# EAGLE design Triggy (EAGLE 7.5.0)
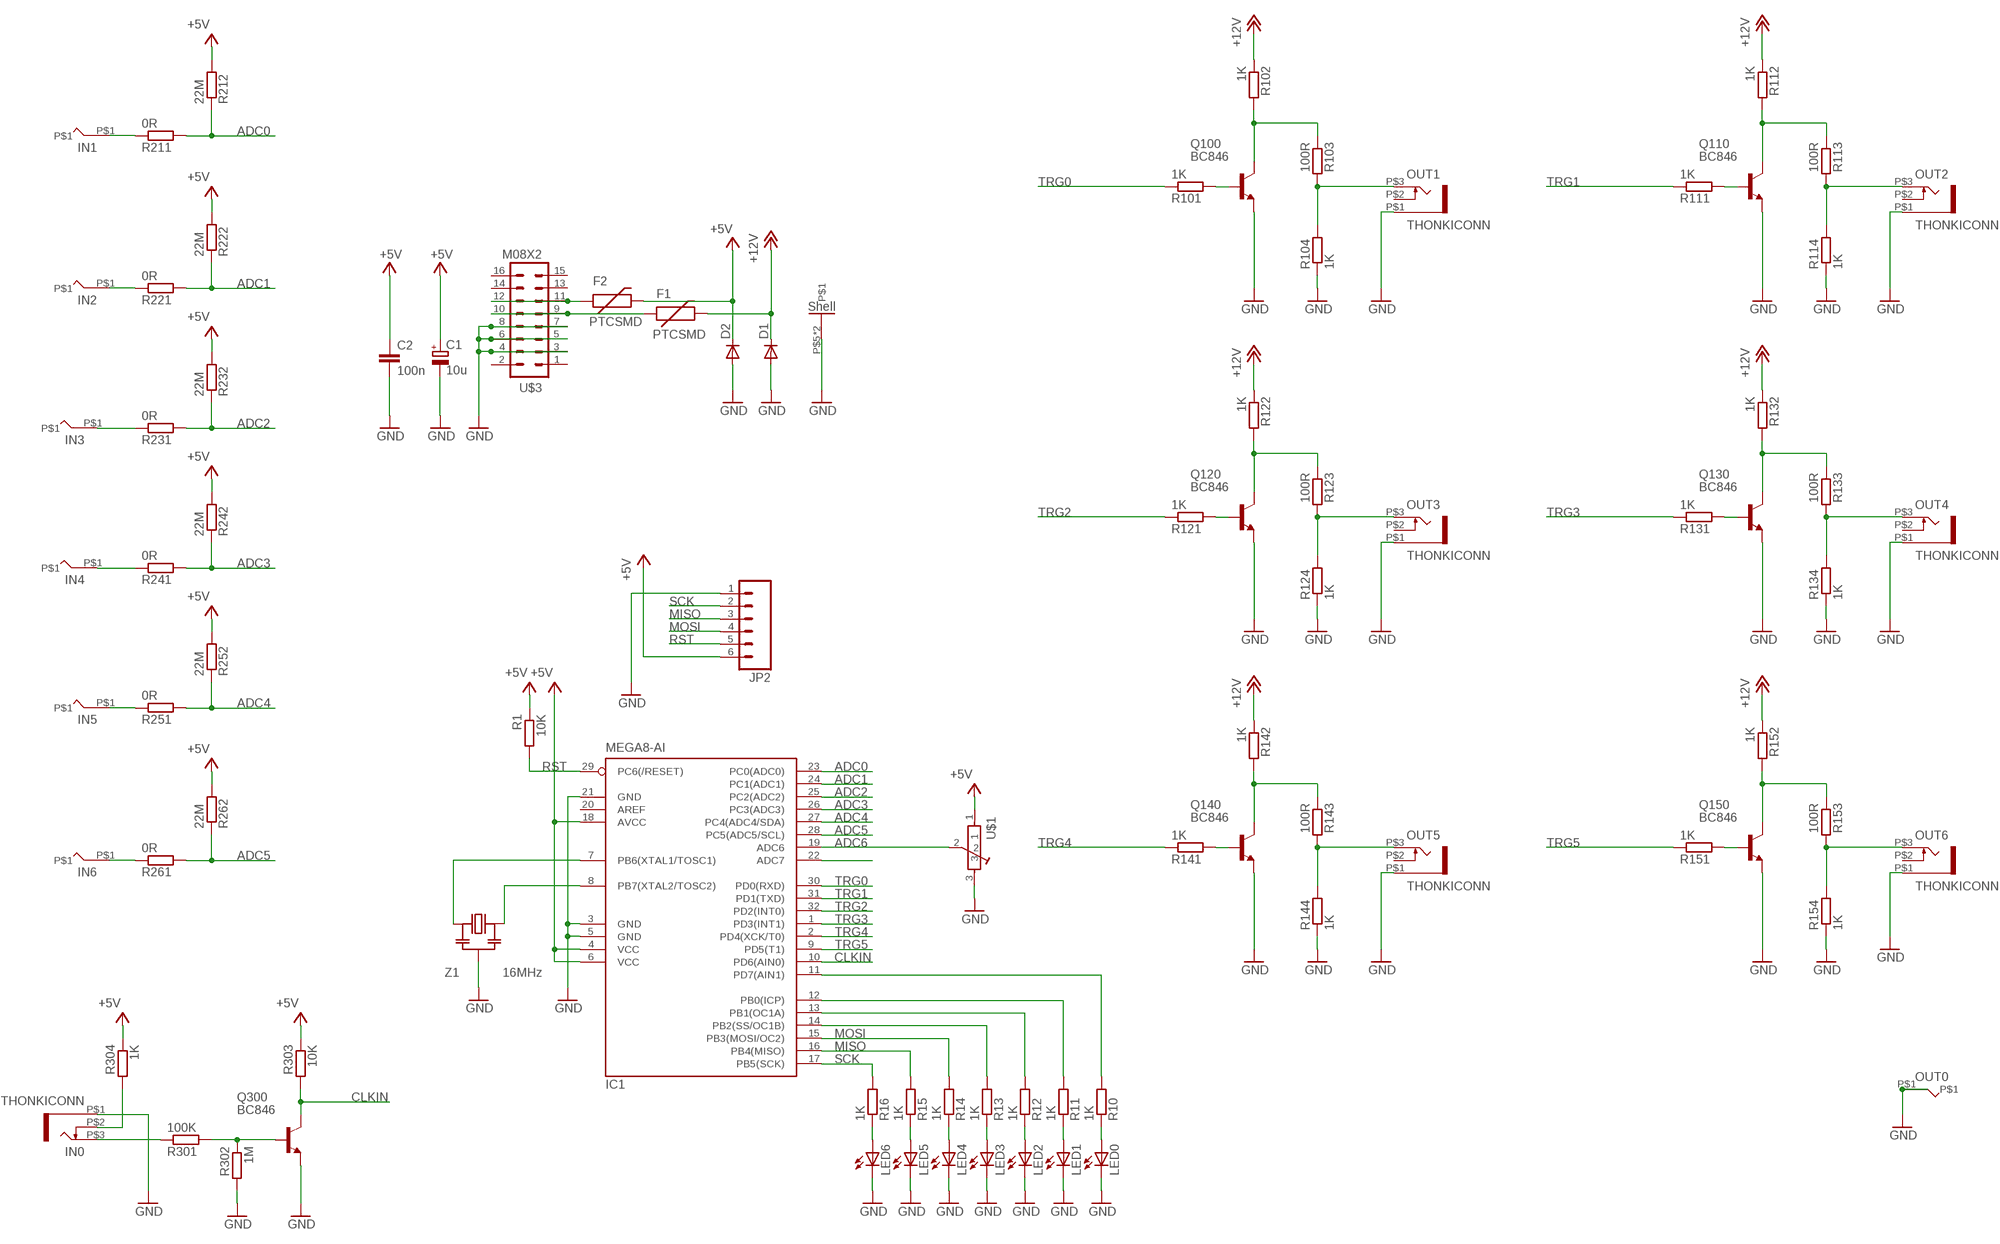
[diagram p0: schematic, sheet 1]

## Parts
C1  10u  CPOL-EUE2.5-6  [E2,5-6]
C2  100n  C-EUC0603  [C0603]
D1  DIODESMA  [SMA-DIODE]
D2  DIODESMA  [SMA-DIODE]
F1  PTCSMD  [PTC-1206]
F2  PTCSMD  [PTC-1206]
IC1  MEGA8-AI  [TQFP32-08]
IN0  THONKICONN  [THONKICONN]
IN1  BANANAJACK  [BANANAJACK]
IN2  BANANAJACK  [BANANAJACK]
IN3  BANANAJACK  [BANANAJACK]
IN4  BANANAJACK  [BANANAJACK]
IN5  BANANAJACK  [BANANAJACK]
IN6  BANANAJACK  [BANANAJACK]
JP2  M06SIP  [1X06]
LED0  LED3MM  [LED3MM]
LED1  LED3MM  [LED3MM]
LED2  LED3MM  [LED3MM]
LED3  LED3MM  [LED3MM]
LED4  LED3MM  [LED3MM]
LED5  LED3MM  [LED3MM]
LED6  LED3MM  [LED3MM]
OUT0  BANANAJACK  [BANANAJACK]
OUT1  THONKICONN  [THONKICONN]
OUT2  THONKICONN  [THONKICONN]
OUT3  THONKICONN  [THONKICONN]
OUT4  THONKICONN  [THONKICONN]
OUT5  THONKICONN  [THONKICONN]
OUT6  THONKICONN  [THONKICONN]
Q100  BC846  [SOT23]
Q110  BC846  [SOT23]
Q120  BC846  [SOT23]
Q130  BC846  [SOT23]
Q140  BC846  [SOT23]
Q150  BC846  [SOT23]
Q300  BC846  [SOT23]
R1  10K  R-EU_0603  [0603]
R10  1K  R-EU_0603  [0603]
R11  1K  R-EU_0603  [0603]
R12  1K  R-EU_0603  [0603]
R13  1K  R-EU_0603  [0603]
R14  1K  R-EU_0603  [0603]
R15  1K  R-EU_0603  [0603]
R16  1K  R-EU_0603  [0603]
R101  1K  R-EU_0603  [0603]
R102  1K  R-EU_0603  [0603]
R103  100R  R-EU_0603  [0603]
R104  1K  R-EU_0603  [0603]
R111  1K  R-EU_0603  [0603]
R112  1K  R-EU_0603  [0603]
R113  100R  R-EU_0603  [0603]
R114  1K  R-EU_0603  [0603]
R121  1K  R-EU_0603  [0603]
R122  1K  R-EU_0603  [0603]
R123  100R  R-EU_0603  [0603]
R124  1K  R-EU_0603  [0603]
R131  1K  R-EU_0603  [0603]
R132  1K  R-EU_0603  [0603]
R133  100R  R-EU_0603  [0603]
R134  1K  R-EU_0603  [0603]
R141  1K  R-EU_0603  [0603]
R142  1K  R-EU_0603  [0603]
R143  100R  R-EU_0603  [0603]
R144  1K  R-EU_0603  [0603]
R151  1K  R-EU_0603  [0603]
R152  1K  R-EU_0603  [0603]
R153  100R  R-EU_0603  [0603]
R154  1K  R-EU_0603  [0603]
R211  0R  R-EU_0603  [0603]
R212  22M  R-EU_0603  [0603]
R221  0R  R-EU_0603  [0603]
R222  22M  R-EU_0603  [0603]
R231  0R  R-EU_0603  [0603]
R232  22M  R-EU_0603  [0603]
R241  0R  R-EU_0603  [0603]
R242  22M  R-EU_0603  [0603]
R251  0R  R-EU_0603  [0603]
R252  22M  R-EU_0603  [0603]
R261  0R  R-EU_0603  [0603]
R262  22M  R-EU_0603  [0603]
R301  100K  R-EU_0603  [0603]
R302  1M  R-EU_0603  [0603]
R303  10K  R-EU_0603  [0603]
R304  1K  R-EU_0603  [0603]
U$1  POT-ALPS-RK09L1140  [POT-ALPS-RK09L1140]
U$3  M08X2  [2X8]
Z1  16MHz  CERAMIC_RESONATOR  [CSTCE_G_A]

## Nets
+5V: C1.+ C2.1 D2.C F2.2 IC1.4(VCC) IC1.6(VCC) IC1.18(AVCC) JP2.6 R1.1 R212.2 R222.2 R232.2 R242.2 R252.2 R262.2 R303.1 R304.1 U$1.1
+12V: D1.C F1.2 R102.1 R112.1 R122.1 R132.1 R142.1 R152.1
ADC0: IC1.23(PC0(ADC0)) R211.2 R212.1
ADC1: IC1.24(PC1(ADC1)) R221.2 R222.1
ADC2: IC1.25(PC2(ADC2)) R231.2 R232.1
ADC3: IC1.26(PC3(ADC3)) R241.2 R242.1
ADC4: IC1.27(PC4(ADC4/SDA)) R251.2 R252.1
ADC5: IC1.28(PC5(ADC5/SCL)) R261.2 R262.1
ADC6: IC1.19(ADC6) U$1.2
ADC7: IC1.22(ADC7)
CLKIN: IC1.10(PD6(AIN0)) Q300.3(C) R303.2
GND: C1.- C2.2 D1.A D2.A IC1.3(GND) IC1.5(GND) IC1.21(GND) IN0.P$1 JP2.1 LED0.K(C) LED1.K(C) LED2.K(C) LED3.K(C) LED4.K(C) LED5.K(C) LED6.K(C) OUT0.P$1 OUT1.P$1 OUT2.P$1 OUT3.P$1 OUT4.P$1 OUT5.P$1 OUT6.P$1 Q100.2(E) Q110.2(E) Q120.2(E) Q130.2(E) Q140.2(E) Q150.2(E) Q300.2(E) R104.1 R114.1 R124.1 R134.1 R144.1 R154.1 R302.2 U$1.3 U$1.P$5 U$1.P$6 U$3.3 U$3.4 U$3.5 U$3.6 U$3.7 U$3.8 Z1.P$2(GND)
MISO: IC1.16(PB4(MISO)) JP2.3 R15.2
MOSI: IC1.15(PB3(MOSI/OC2)) JP2.4 R14.2
N$1: IN6.P$1 R261.1
N$2: F2.1 U$3.11 U$3.12
N$3: IN2.P$1 R221.1
N$4: IN4.P$1 R241.1
N$5: IN0.P$2 R304.2
N$6: IC1.8(PB7(XTAL2/TOSC2)) Z1.P$3(OUT)
N$7: F1.1 U$3.9 U$3.10
N$8: IN1.P$1 R211.1
N$9: IN3.P$1 R231.1
N$10: LED6.A R16.1
N$11: IC1.7(PB6(XTAL1/TOSC1)) Z1.P$1(IN)
N$12: IN5.P$1 R251.1
N$13: IC1.12(PB0(ICP)) R11.2
N$14: Q120.1(B) R121.2
N$15: OUT3.P$3 R123.2 R124.2
N$16: Q120.3(C) R122.2 R123.1
N$17: Q140.1(B) R141.2
N$18: OUT5.P$3 R143.2 R144.2
N$19: Q140.3(C) R142.2 R143.1
N$20: IC1.13(PB1(OC1A)) R12.2
N$21: IC1.14(PB2(SS/OC1B)) R13.2
N$22: LED5.A R15.1
N$23: Q110.1(B) R111.2
N$24: OUT2.P$3 R113.2 R114.2
N$25: Q110.3(C) R112.2 R113.1
N$26: Q130.1(B) R131.2
N$27: Q300.1(B) R301.2 R302.1
N$28: IN0.P$3 R301.1
N$29: OUT4.P$3 R133.2 R134.2
N$30: Q130.3(C) R132.2 R133.1
N$31: IC1.11(PD7(AIN1)) R10.2
N$32: Q150.1(B) R151.2
N$33: Q100.1(B) R101.2
N$34: OUT6.P$3 R153.2 R154.2
N$35: Q150.3(C) R152.2 R153.1
N$36: OUT1.P$3 R103.2 R104.2
N$37: Q100.3(C) R102.2 R103.1
N$38: LED4.A R14.1
N$39: LED3.A R13.1
N$40: LED2.A R12.1
N$41: LED1.A R11.1
N$42: LED0.A R10.1
RST: IC1.29(PC6(/RESET)) JP2.5 R1.2
SCK: IC1.17(PB5(SCK)) JP2.2 R16.2
TRG0: IC1.30(PD0(RXD)) R101.1
TRG1: IC1.31(PD1(TXD)) R111.1
TRG2: IC1.32(PD2(INT0)) R121.1
TRG3: IC1.1(PD3(INT1)) R131.1
TRG4: IC1.2(PD4(XCK/T0)) R141.1
TRG5: IC1.9(PD5(T1)) R151.1
Unconnected: IC1.20(AREF) OUT1.P$2 OUT2.P$2 OUT3.P$2 OUT4.P$2 OUT5.P$2 OUT6.P$2 U$3.1 U$3.2 U$3.13 U$3.14 U$3.15 U$3.16

## Library data of the parts
C1 = resistor:CPOL-EU: POLARIZED CAPACITOR, European symbol
C2 = rcl:C-EU: CAPACITOR, European symbol
D1 D2 = SparkFun:DIODE: Diode These are standard reverse protection diodes and small signal diodes. SMA package can handle up to about 1A. SOD-323 can handle about 200mA. What the SOD-323 package when ordering, there are some mfgs out there that are 5-pin packages.
F1 F2 = SparkFun:PTC: Resettable Fuse PTC Resettable Fuse. Spark Fun Electronics SKU : COM-08357
IC1 = atmel:MEGA8: MICROCONTROLLER 8 Kbytes FLASH, 1 kbytes SRAM, 512 bytes EEPROM, USART, 6-channel 10 bit ADC, 2-channel 8 bit ADC Pin compatible with Atmega48, ATMega88, ATMega168 Source: avr.lbr; MPN: ATMEGA8-16AU; OC_FARNELL: 9171371; OC_NEWARK: 73M8863
IN0 OUT1-OUT6 = Rebel:THONKICONN
IN1-IN6 OUT0 = Rebel:BANANAJACK
JP2 = SparkFun:M06: Header 6 Standard 6-pin 0.1" header. Use with straight break away headers (SKU : PRT-00116), right angle break away headers (PRT-00553), swiss pins (PRT-00743), machine pins (PRT-00117), and female headers (PRT-00115). Molex polarized connector foot print use with SKU : PRT-08094 with associated crimp pins and housings. NOTES ON THE VARIANTS LOCK and LOCK_LONGPADS... This footprint was designed to help hold the alignment of a through-hole component (i.e. 6-pin header) while soldering it into place. You may notice that each hole has been shifted either up or down by 0.005 of an inch from it's more standard position (which is a perfectly straight line). This slight alteration caused the pins (the squares in the middle) to touch the edges of the holes. Because they are alternating, it causes a "brace" to hold the component in place. 0.005 has proven to be the perfect amount of "off-center" position when using our standard breakaway headers. Although looks a little odd when you look at the bare footprint, once you have a header in there, the alteration is very hard to notice. Also, if you push a header all the way into place, it is covered up entirely on the bottom side. This idea of altering the position of holes to aid alignment will be further integrated into the Sparkfun Library for other footprints. It can help hold any component with 3 or more connection pins.
LED0 LED1-LED6 = Rebel:LED: LED OSRAM: - CHIPLED LG R971, LG N971, LY N971, LG Q971, LY Q971, LO R971, LY R971 LH N974, LH R974 LS Q976, LO Q976, LY Q976 LO Q996 - Hyper CHIPLED LW Q18S LB Q993, LB Q99A, LB R99A - SideLED LS A670, LO A670, LY A670, LG A670, LP A670 LB A673, LV A673, LT A673, LW A673 LH A674 LY A675 LS A676, LA A676, LO A676, LY A676, LW A676 LS A679, LY A679, LG A679 - Hyper Micro SIDELED® LS Y876, LA Y876, LO Y876, LY Y876 LT Y87S - SmartLED LW L88C, LW L88S LB L89C, LB L89S, LG L890 LS L89K, LO L89K, LY L89K LS L896, LA L896, LO L896, LY L896 - TOPLED LS T670, LO T670, LY T670, LG T670, LP T670 LSG T670, LSP T670, LSY T670, LOP T670, LYG T670 LG T671, LOG T671, LSG T671 LB T673, LV T673, LT T673, LW T673 LH T674 LS T676, LA T676, LO T676, LY T676, LB T676, LH T676, LSB T676, LW T676 LB T67C, LV T67C, LT T67C, LS T67K, LO T67K, LY T67K, LW E67C LS E67B, LA E67B, LO E67B, LY E67B, LB E67C, LV E67C, LT E67C LW T67C LS T679, LY T679, LG T679 LS T770, LO T770, LY T770, LG T770, LP T770 LB T773, LV T773, LT T773, LW T773 LH T774 LS E675, LA E675, LY E675, LS T675 LS T776, LA T776, LO T776, LY T776, LB T776 LHGB T686 LT T68C, LB T68C - Hyper Mini TOPLED® LB M676 - Mini TOPLED Santana® LG M470 LS M47K, LO M47K, LY M47K Source: http://www.osram.convergy.de LUXEON: - LUMILED® LXK2-PW12-R00, LXK2-PW12-S00, LXK2-PW14-U00, LXK2-PW14-V00 LXK2-PM12-R00, LXK2-PM12-S00, LXK2-PM14-U00 LXK2-PE12-Q00, LXK2-PE12-R00, LXK2-PE12-S00, LXK2-PE14-T00, LXK2-PE14-U00 LXK2-PB12-K00, LXK2-PB12-L00, LXK2-PB12-M00, LXK2-PB14-N00, LXK2-PB14-P00, LXK2-PB14-Q00 LXK2-PR12-L00, LXK2-PR12-M00, LXK2-PR14-Q00, LXK2-PR14-R00 LXK2-PD12-Q00, LXK2-PD12-R00, LXK2-PD12-S00 LXK2-PH12-R00, LXK2-PH12-S00 LXK2-PL12-P00, LXK2-PL12-Q00, LXK2-PL12-R00 Source: www.luxeon.com KINGBRIGHT: KA-3528ASYC Source: www.kingbright.com
Q100 Q110 Q120 Q130 Q140 Q150 Q300 = transistor-neu-to92:BC846: NPN TRANSISTOR
R1 R10-R16 R101-R104 R111-R114 R121-R124 R131-R134 R141-R144 R151-R154 R211 R212 R221 R222 R231 R232 R241 R242 R251 R252 R261 R262 R301-R304 = Rebel:R-EU_: RESISTOR, European symbol
U$1 = Rebel:POT-ALPS-RK09L
U$3 = SparkFun:M08X2
Z1 = Rebel:CERAMIC_RESONATOR: Murata Ceralock Ceramic Resonators. CSTCC_G 2.00 - 3.99MHz CSTCR_G 4.00 - 7.99MHz CSTCE_G 8.00 - 13.99MHz

## Board
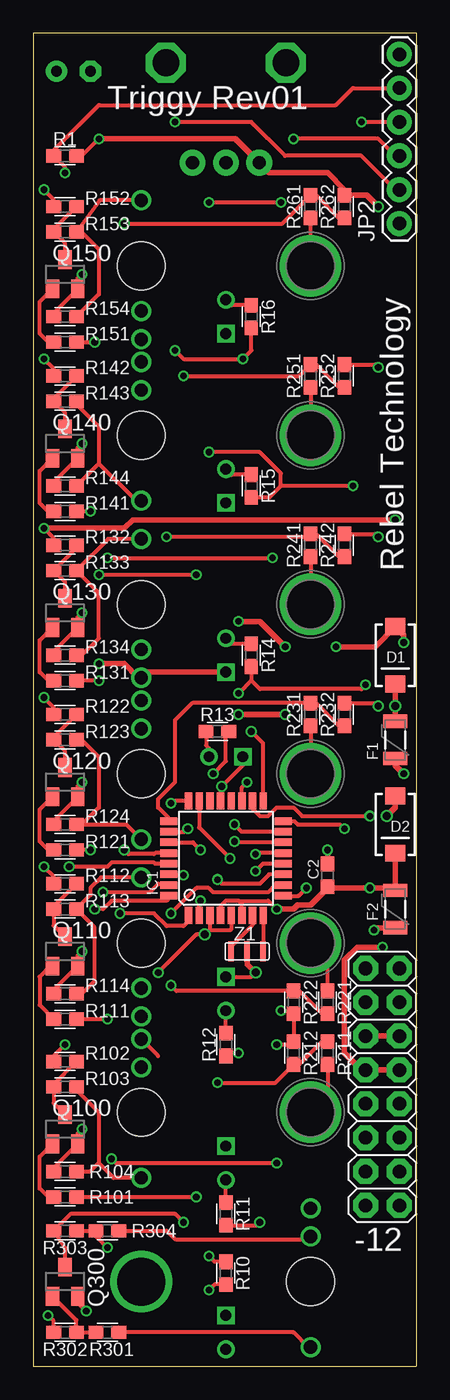
[diagram p1: board, top side]
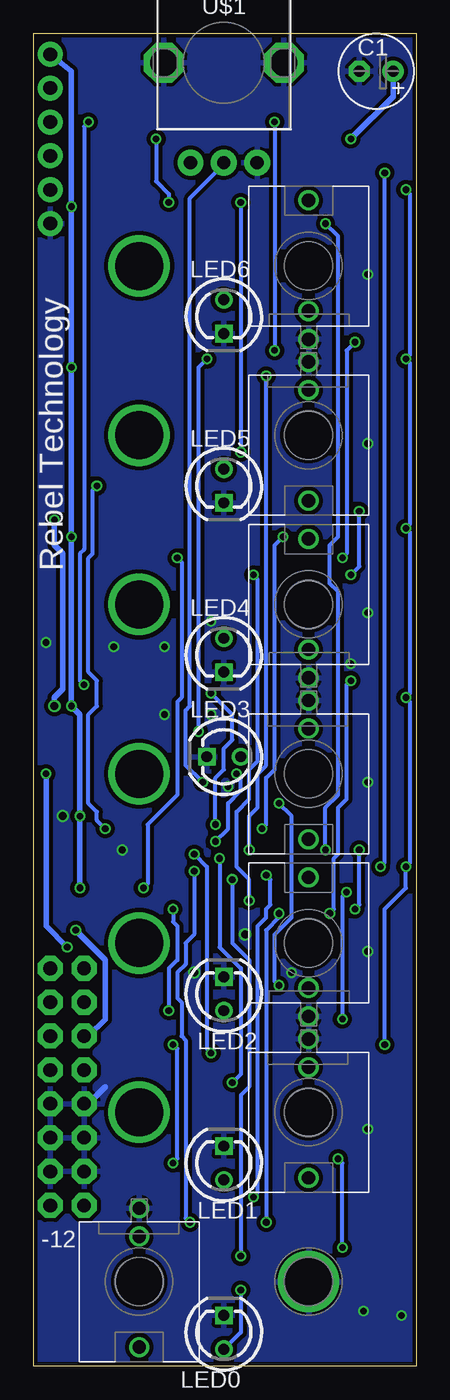
[diagram p2: board, bottom side, seen from below]

Size 28.73 x 100 mm. Coordinates in mm from the lower left corner, seen from the top.
Outline: 28.73,100 0,100 0,0 28.73,0 28.73,100
Copper layers (1*16): Top 0.035mm / dielectric 1.5mm / Bottom 0.035mm
Design rules "Fusion_eagle_rule_v1.1": minimum track width 6mil, minimum drill 12mil, track to track 6mil, track to pad 6mil, pad to pad 6mil, via to via 6mil, smd to smd 0mil, copper to edge 10mil, drill to drill 10mil, minimum pad ring 10mil, minimum via ring 6mil, stop-mask expansion 2mil, vias tented up to drill 100mil, thermal gap 10mil

### Footprints (pad centres in the part's own frame; a part is rotated, then mirrored left to right if it is on the bottom)
E2,5-6 = drill 0.813 pad 1.6: + -1.27,0 | drill 0.813 pad 1.6 octagon: - 1.27,0
C0603 = smd 1.1 x 1: 1 -0.85,0; 2 0.85,0
SMA-DIODE = smd 1.27 x 1.47: A -2.15,0; C 2.15,0
PTC-1206 = smd 1 x 1.8: 1 -1.4,0; 2 1.4,0
TQFP32-08 = smd 1.27 x 0.559: 1 -4.293,2.8; 2 -4.293,2; 3 -4.293,1.2; 4 -4.293,0.4; 5 -4.293,-0.4; 6 -4.293,-1.2; 7 -4.293,-2; 8 -4.293,-2.8; 17 4.293,-2.8; 18 4.293,-2; 19 4.293,-1.2; 20 4.293,-0.4; 21 4.293,0.4; 22 4.293,1.2; 23 4.293,2; 24 4.293,2.8 | smd 0.559 x 1.27: 9 -2.8,-4.293; 10 -2,-4.293; 11 -1.2,-4.293; 12 -0.4,-4.293; 13 0.4,-4.293; 14 1.2,-4.293; 15 2,-4.293; 16 2.8,-4.293; 25 2.8,4.293; 26 2,4.293; 27 1.2,4.293; 28 0.4,4.293; 29 -0.4,4.293; 30 -1.2,4.293; 31 -2,4.293; 32 -2.8,4.293
THONKICONN = drill 1: P$1 0,-5.5; P$2 0,-3.38; P$3 0,4.92 | hole 3.6: 0,0
BANANAJACK = drill 3.6: P$1 0,0
1X06 = drill 1.016 pad 1.88: 1 0,0; 2 2.54,0; 3 5.08,0; 4 7.62,0; 5 10.16,0; 6 12.7,0
LED3MM = drill 0.813: A -1.27,0 | drill 0.813 square: K 1.27,0
SOT23 = smd 1 x 1.4: 1 -0.95,-1.1; 2 0.95,-1.1; 3 0,1.1
0603 = smd 1.1 x 1: 1 -0.85,0; 2 0.85,0
POT-ALPS-RK09L1140 = drill 1 pad 1.93: 1 -2.5,-7.5; 2 0,-7.5; 3 2.5,-7.5 | drill 2 octagon: P$5 -4.5,0; P$6 4.5,0
2X8 = drill 1.016 pad 1.88 octagon: 1 0,0; 2 0,2.54; 3 2.54,0; 4 2.54,2.54; 5 5.08,0; 6 5.08,2.54; 7 7.62,0; 8 7.62,2.54; 9 10.16,0; 10 10.16,2.54; 11 12.7,0; 12 12.7,2.54; 13 15.24,0; 14 15.24,2.54; 15 17.78,0; 16 17.78,2.54
CSTCE_G_A = smd 0.4 x 1.5: P$1 -1.2,0; P$2 0,0; P$3 1.2,0

### Placement (x,y rotation side)
C1  3.01,97.16 180 bottom
C2  22.06,36.83 90 top
D1  27.14,53.34 270 top
D2  27.14,40.64 270 top
F1  27.14,46.99 90 top
F2  27.14,34.29 90 top
IC1  14.44,38.1 90 top
IN0  20.79,6.35 180 bottom
IN1  20.79,19.05 0 top
IN2  20.79,31.75 0 top
IN3  20.79,44.45 0 top
IN4  20.79,57.15 0 top
IN5  20.79,69.85 0 top
IN6  20.79,82.55 0 top
JP2  27.46,85.72 90 top
LED0  14.44,2.54 90 bottom
LED1  14.44,15.24 90 bottom
LED2  14.44,27.94 90 bottom
LED3  14.44,45.72 180 bottom
LED4  14.44,53.34 270 bottom
LED5  14.44,66.04 270 bottom
LED6  14.44,78.74 270 bottom
OUT0  8.09,6.35 180 bottom
OUT1  8.09,19.05 180 bottom
OUT2  8.09,31.75 0 bottom
OUT3  8.09,44.45 180 bottom
OUT4  8.09,57.15 0 bottom
OUT5  8.09,69.85 180 bottom
OUT6  8.09,82.55 0 bottom
Q100  2.38,17.78 0 top
Q110  2.38,31.11 0 top
Q120  2.38,43.81 0 top
Q130  2.38,56.52 0 top
Q140  2.38,69.22 0 top
Q150  2.38,81.92 0 top
Q300  2.38,6.35 0 top
R1  2.38,90.81 180 top
R10  14.44,6.99 90 top
R11  14.44,11.43 270 top
R12  14.44,24.13 270 top
R13  13.81,47.62 0 top
R14  16.35,53.34 270 top
R15  16.35,66.04 270 top
R16  16.35,78.74 270 top
R101  2.38,12.7 180 top
R102  2.38,22.86 0 top
R103  2.38,20.95 0 top
R104  2.38,14.61 0 top
R111  2.38,26.04 180 top
R112  2.38,36.2 0 top
R113  2.38,34.29 0 top
R114  2.38,27.94 0 top
R121  2.38,38.73 180 top
R122  2.38,48.9 0 top
R123  2.38,46.99 0 top
R124  2.38,40.64 0 top
R131  2.38,51.44 180 top
R132  2.38,61.59 0 top
R133  2.38,59.69 0 top
R134  2.38,53.34 0 top
R141  2.38,64.14 180 top
R142  2.38,74.3 0 top
R143  2.38,72.39 0 top
R144  2.38,66.04 0 top
R151  2.38,76.83 180 top
R152  2.38,87 0 top
R153  2.38,85.09 0 top
R154  2.38,78.74 0 top
R211  22.06,23.5 90 top
R212  19.52,23.5 90 top
R221  22.06,27.3 270 top
R222  19.52,27.3 270 top
R231  20.79,48.9 90 top
R232  23.33,48.9 90 top
R241  20.79,61.59 90 top
R242  23.33,61.59 90 top
R251  20.79,74.3 90 top
R252  23.33,74.3 90 top
R261  20.79,87 90 top
R262  23.33,87 90 top
R301  5.55,2.54 180 top
R302  2.38,2.54 180 top
R303  2.38,10.16 180 top
R304  5.55,10.16 0 top
U$1  14.44,97.79 0 bottom
U$3  27.46,12.06 90 top
Z1  16.03,31.11 0 top

### Tracks (layer width: path | path; a pad name or v marks a point on that pad's centre or on a via)
+5V  (via drill 0.5)
  Top 0.305: 15.39,34.92 14.44,34.92 14.04,34.52 IC1.4 | IC1.6 15.64,34.68 15.39,34.92 | R303.1 R304.1 4.7,9.74 v5.55,8.89 | R252.2 25.66,75.14 v25.87,74.93 | R242.2 25.66,62.45 v25.87,62.23 | R232.2 25.66,49.74 v25.87,49.53 | IC1.18 16.44,41.81 16.98,41.27 17.62,41.27 18.25,41.91 19.52,41.91 20.16,41.27 v25.24,41.27 | 15.39,34.92 17.62,34.92 v18.25,34.29 | R262.2 23.33,88.27 | R1.1 3.65,90.81 v4.92,92.08 | v5.87,15.56 6.19,15.24 v18.25,15.24 | v18.25,24.13 19.52,24.13 R212.2 R222.2 19.31,26.67 v18.57,26.67
  Top 0.406: D2.C F2.2 26.96,35.88 v25.24,35.88 22.17,35.88 C2.1 22.06,35.88 20.79,34.61 19.84,34.61 19.52,34.29 v18.25,34.29 | R262.2 25.02,87.84 v25.87,87 | 23.33,88.27 22.06,89.53 17.7,89.53 U$1.1 15.16,92.08 v4.92,92.08
  Bottom 0.305: v5.55,8.89 5.55,15.24 v5.87,15.56 | v18.25,15.24 17.94,15.56 17.94,23.81 v18.25,24.13 | v18.25,34.29 18.25,33.34 17.94,33.02 17.94,30.48 18.57,29.84 v18.57,26.67
  Bottom 0.406: JP2.6 25.87,97.16 v25.87,87 v25.87,74.93 v25.87,62.23 v25.87,49.53 25.24,48.9 v25.24,41.27 v25.24,35.88 | C1.+ 1.74,95.25 v4.92,92.08
+12V  (via drill 0.5, 0.6)
  Top 0.305: R102.1 1.53,23.28 v2.38,24.13 | R122.1 1.53,49.43 v0.79,50.16 | R132.1 1.53,62.13 v0.79,62.87 | R142.1 1.53,74.83 v0.79,75.56 | R152.1 1.53,87.53 v0.79,88.27 | R112.1 1.53,36.73 v0.79,37.47
  Top 0.406: F1.2 v27.14,49.53 D1.C | v0.79,62.87 6.82,62.87 7.46,63.5 v27.14,63.5
  Bottom 0.305: v2.38,24.13 2.38,34.29 0.79,35.88 v0.79,37.47 0.47,37.78 0.47,49.85 v0.79,50.16 0.47,50.48 0.47,62.55 v0.79,62.87 0.47,63.18 0.47,75.25 v0.79,75.56 0.47,75.88 0.47,87.95 v0.79,88.27
  Bottom 0.406: v27.14,63.5 27.14,61.59 26.51,60.96 26.51,50.8 27.14,50.16 v27.14,49.53
ADC0  (via drill 0.5)
  Top 0.305: R211.2 21.64,24.34 19.94,22.64 R212.1 18.15,21.27 v13.81,21.27 | IC1.23 12.44,40.42 v14.76,38.1
  Bottom 0.305: v14.76,38.1 14.76,31.43 13.17,29.84 13.17,21.91 v13.81,21.27
ADC1  (via drill 0.5)
  Top 0.305: R221.2 21.64,26.45 19.94,28.16 R222.1 10.74,28.16 v10.32,28.57 | IC1.24 10.48,42.39 v10.32,42.23
  Bottom 0.305: v10.32,28.57 10.63,28.89 10.63,32.38 9.36,33.66 9.36,41.27 v10.32,42.23
ADC2
  Top 0.305: R232.1 22.91,48.05 21.21,49.74 R231.2 11.9,49.74 10.63,48.48 10.63,43.81 9.36,42.55 9.36,41.91 10.15,41.12 IC1.25
ADC3  (via drill 0.5)
  Top 0.305: R242.1 22.91,60.74 21.21,62.45 R241.2 20.58,62.23 v10,62.23 | IC1.26 11.36,40.1 v11.58,40.32
  Bottom 0.305: v11.58,40.32 11.27,40.64 11.27,44.13 10.63,44.77 10.63,61.59 v10,62.23
ADC4  (via drill 0.5)
  Top 0.305: R252.1 22.91,73.44 21.21,75.14 R251.2 19.94,74.3 v11.27,74.3 | IC1.27 11.97,39.3 v12.54,38.73
  Bottom 0.305: v12.54,38.73 12.54,41.27 11.9,41.91 11.9,44.45 11.27,45.09 v11.27,74.3
ADC5  (via drill 0.5)
  Top 0.305: R262.1 22.91,86.14 21.21,87.84 R261.2 18.67,85.72 v6.82,85.72 | IC1.28 9.13,38.5 9.05,38.42 7.14,38.42 v6.82,38.73
  Bottom 0.305: v6.82,38.73 6.82,41.91 5.87,42.86 5.87,58.1 6.5,58.74 6.5,61.59 5.87,62.23 5.87,84.77 v6.82,85.72
ADC6  (via drill 0.5)
  Top 0.305: IC1.19 15.64,43.43 v16.03,43.81
  Bottom 0.305: v16.03,43.81 17.3,45.09 17.3,49.21 16.98,49.53 16.98,87.63 14.44,90.17 U$1.2
CLKIN  (via drill 0.5)
  Top 0.305: 2.38,7.41 Q300.3 2.38,8.89 R303.2 2.8,11.43 10.63,11.43 v11.27,10.79 | IC1.10 18.16,36.1 17.62,35.56 13.49,35.56 13.17,35.88 12.22,35.88 v10.32,33.97
  Bottom 0.305: v10.32,33.97 10.32,33.66 11.27,32.7 v11.27,10.79
GND  (via drill 0.5, 0.6)
  Top 0.305: IC1.5 14.84,32.78 14.76,32.7 13.31,32.7 13.24,32.77 | IC1.3 13.24,32.77 | v3.65,17.78 3.33,17.46 Q100.2 1.53,14.88 R104.1 | v3.65,31.11 3.33,30.8 Q110.2 1.53,28.21 R114.1 | Q300.2 3.33,4.76 v3.96,4.13 | R124.1 1.53,40.91 Q120.2 3.33,43.49 v3.65,43.81 | R134.1 1.53,53.62 Q130.2 3.33,56.2 v3.65,56.52 | R144.1 1.53,66.31 Q140.2 3.33,68.89 v3.65,69.22 | v3.65,81.92 3.33,81.59 Q150.2 1.53,79.02 R154.1 | IC1.21 14.04,43.41 v14.12,43.5 15.71,45.09 LED3.K | v9.36,29.53 12.22,32.38 v12.85,32.38 13.24,32.77 | 9.36,23.28 OUT1.P$1 | R302.2 1.53,3.39 v1.11,3.81 | LED2.K 16.35,29.21 v16.67,29.53
  Top 0.406: D2.A 27.14,41.91 v26.51,41.27 | D1.A 26.75,55.49 | v22.7,53.98 25.63,53.98 D1.A | v27.78,54.29 27.78,54.85 D1.A | C2.2 v22.06,38.73 | LED4.K 8.51,52.07 OUT4.P$1 7.88,51.65 6.82,52.7 v4.92,52.7 | v15.39,55.88 16.98,55.88 v18.89,53.98 | v15.39,48.9 v18.89,48.9 | Z1.P$2 16.03,30.16 v16.67,29.53
  Bottom 0.406: 24.6,19.68 23.33,20.95
  pour Bottom (isolate 0.305): 29.68,0 -2.07,0 -2.07,100.33 29.68,100.33
MISO  (via drill 0.5)
  Top 0.305: IC1.16 19.58,40.9 19.84,40.64 23.01,40.64 v23.33,40.32 | v23.97,66.04 18.57,66.04 | 18.57,66.04 18.57,66.99 16.98,68.58 v13.17,68.58 | JP2.3 27.14,90.81 25.87,92.08 v19.52,92.08 | v18.57,87.31 v13.17,87.31 | R15.2 17.72,65.19 18.57,66.04
  Bottom 0.305: v23.33,40.32 23.97,40.96 23.97,41.59 24.6,42.23 24.6,48.9 23.97,49.53 23.97,51.44 24.6,52.07 24.6,60.64 24.28,60.96 24.28,65.72 v23.97,66.04 | v19.52,92.08 19.52,88.9 18.57,87.95 v18.57,87.31 | v13.17,87.31 v13.17,68.58
MOSI  (via drill 0.5)
  Top 0.305: IC1.15 15.62,40.1 v15.08,40.64 | JP2.4 v24.6,93.34 | R14.2 16.35,51.44 | 16.35,51.44 v15.39,50.48 | v24.92,51.12 24.6,50.8 16.98,50.8 16.35,51.44
  Bottom 0.305: v15.08,40.64 15.08,44.13 14.44,44.77 14.44,46.35 13.81,46.99 13.81,48.9 v15.39,50.48 15.71,50.8 | v24.6,93.34 24.92,93.03 24.92,61.28 25.24,60.96 25.24,51.44 v24.92,51.12
N$1
  Top 0.305: IN6.P$1 R261.1
N$2  (via drill 0.5)
  Top 0.406: F2.1 25.74,32.89 v25.55,32.7 | U$3.11 U$3.12
  Bottom 0.406: v25.55,32.7 23.33,30.48 23.33,26.04 24.6,24.77 U$3.12
N$3
  Top 0.305: R221.1 22.06,30.48 IN2.P$1
N$4
  Top 0.305: R241.1 IN4.P$1
N$5
  Top 0.305: R304.2 10,10.16 10.63,9.53 20.59,9.53 IN0.P$2
N$6
  Top 0.305: IC1.8 17.24,31.13 Z1.P$3
N$7  (via drill 0.5)
  Top 0.406: v26.19,31.43 24.28,31.43 23.33,30.48 23.33,23.5 24.6,22.23 U$3.10 U$3.9 | F1.1 27.14,45.09 v27.78,44.45
  Bottom 0.406: v27.78,44.45 27.78,33.02 v26.19,31.43
N$8
  Top 0.305: R211.1 22.06,20.32 IN1.P$1
N$9
  Top 0.305: R231.1 IN3.P$1
N$10
  Top 0.305: R16.1 14.86,79.59 LED6.A
N$11
  Top 0.305: IC1.7 16.44,33.12 14.83,31.5 Z1.P$1
N$12
  Top 0.305: R251.1 IN5.P$1
N$13  (via drill 0.5)
  Top 0.305: IC1.12 17.22,37.7 v16.67,37.15 | R11.2 16.77,10.58 v16.98,10.79
  Bottom 0.305: v16.67,37.15 16.67,32.38 17.3,31.75 17.3,30.16 17.94,29.53 17.94,27.62 17.62,27.3 17.62,24.77 17.3,24.45 17.3,11.11 v16.98,10.79
N$14
  Top 0.305: R121.2 1.11,38.73 0.47,39.37 0.47,41.76 Q120.1
N$15
  Top 0.305: 3.65,40.64 6.98,40.64 OUT3.P$3 | R123.2 3.65,46.99 4.92,45.72 4.92,41.91 3.65,40.64 | 3.65,40.64 R124.2
N$16
  Top 0.305: Q120.3 2.38,46.14 R123.1 1.53,47.2 R122.2
N$17
  Top 0.305: R141.2 1.11,64.14 0.47,64.77 0.47,67.16 Q140.1
N$18
  Top 0.305: R143.2 3.23,72.17 4.92,70.48 4.92,67.73 | 4.92,67.73 R144.2 | OUT5.P$3 7.72,64.93 4.92,67.73
N$19
  Top 0.305: Q140.3 2.38,71.54 R143.1 1.53,72.59 R142.2
N$20  (via drill 0.5)
  Top 0.305: IC1.13 16.75,38.5 v16.67,38.42 | v15.39,23.5 14.66,23.5 R12.2
  Bottom 0.305: v16.67,38.42 15.71,37.47 15.71,23.81 v15.39,23.5
N$21  (via drill 0.5)
  Top 0.305: IC1.14 15.15,39.3 v15.08,39.37 | v13.49,44.45 14.44,45.4 14.44,47.2 R13.2
  Bottom 0.305: v15.08,39.37 14.12,40.32 14.12,42.23 13.17,43.18 13.17,44.13 v13.49,44.45
N$22
  Top 0.305: R15.1 14.86,66.89 LED5.A
N$23
  Top 0.305: Q110.1 1.28,30.02 0.47,29.21 0.47,27.09 R111.2
N$24
  Top 0.305: R114.2 3.65,27.94 4.6,28.89 4.6,32.92 R113.2 4.28,35.34 4.28,35.88 5.08,36.67 OUT2.P$3
N$25
  Top 0.305: Q110.3 1.53,33.06 R113.1 1.53,34.49 R112.2
N$26
  Top 0.305: R131.2 1.11,51.44 0.47,52.07 0.47,54.46 Q130.1
N$27
  Top 0.305: Q300.1 3.23,3.45 R302.1 R301.2
N$28
  Top 0.305: IN0.P$3 20.63,1.43 19.52,2.54 R301.1
N$29
  Top 0.305: R134.2 3.65,53.34 4.92,54.61 4.92,58 R133.2 5.61,62.07 OUT4.P$3
N$30
  Top 0.305: R132.2 3.23,61.39 R133.1 2.38,58.84 Q130.3
N$31  (via drill 0.5)
  Top 0.305: IC1.11 17.69,36.9 16.98,36.2 14.12,36.2 v13.81,36.51 | R10.2 13.59,7.83 v13.17,8.26
  Bottom 0.305: v13.81,36.51 13.81,31.75 12.54,30.48 12.54,20.95 13.17,20.32 v13.17,8.26
N$32
  Top 0.305: R151.2 1.11,76.83 0.47,77.47 0.47,79.86 Q150.1
N$33
  Top 0.305: R101.2 1.11,12.7 0.47,13.34 0.47,15.72 Q100.1
N$34
  Top 0.305: OUT6.P$3 4.97,87.47 R153.2 3.65,85.09 4.92,83.82 4.92,80.43 R154.2
N$35
  Top 0.305: Q150.3 2.38,84.24 R153.1 1.53,85.3 R152.2
N$36
  Top 0.305: R103.2 3.23,20.74 4.92,19.05 4.92,15.24 | R104.2 4.28,14.61 4.92,15.24 | OUT1.P$3 6.03,14.13 4.92,15.24
N$37
  Top 0.305: Q100.3 1.53,19.73 R103.1 1.53,21.16 R102.2
N$38
  Top 0.305: R14.1 14.86,54.19 LED4.A
N$39
  Top 0.305: LED3.A 13.17,46.35 12.96,46.57 R13.1
N$40
  Top 0.305: R12.1 LED2.A
N$41
  Top 0.305: R11.1 LED1.A
N$42  (via drill 0.5)
  Top 0.305: R10.1 13.59,6.13 v13.17,5.71
  Bottom 0.305: v13.17,5.71 13.17,2.54 LED0.A
RST  (via drill 0.5)
  Top 0.305: IC1.29 9.13,37.7 9.05,37.78 5.87,37.78 5.55,37.47 v2.7,37.47 | JP2.5 23.97,95.89 22.7,94.61 4.92,94.61 1.53,91.22 R1.2 2.38,89.95 v2.38,89.53
  Bottom 0.305: v2.7,37.47 2.38,37.78 v2.38,89.53
SCK  (via drill 0.5)
  Top 0.305: v16.35,47.62 17.24,46.73 IC1.17 | JP2.2 27.14,88.27 24.6,90.81 18.89,90.81 16.35,93.34 v10.63,93.34 | R16.2 16.35,76.2 v15.71,75.56 11.27,75.56 v10.63,76.2
  Bottom 0.305: v16.35,47.62 16.35,74.93 v15.71,75.56 | v10.63,93.34 v10.63,76.2
TRG0  (via drill 0.5)
  Top 0.305: R101.1 v12.22,12.7 | v11.27,36.83 10.22,36.83 IC1.30
  Bottom 0.305: v12.22,12.7 11.9,13.02 11.9,33.02 11.27,33.66 11.27,34.29 10.95,34.61 10.95,36.51 v11.27,36.83
TRG1  (via drill 0.5)
  Top 0.305: IC1.31 10.05,36.2 9.36,36.2 8.73,35.56 v5.24,35.56 | v5.55,26.04 R111.1
  Bottom 0.305: v5.24,35.56 5.55,35.24 v5.55,26.04
TRG2  (via drill 0.5)
  Top 0.305: IC1.32 10.15,35.08 10,34.92 5.87,34.92 5.24,34.29 v4.6,34.29 | v4.28,38.73 R121.1
  Bottom 0.305: v4.6,34.29 4.28,34.61 v4.28,38.73
TRG3  (via drill 0.5)
  Top 0.305: IC1.1 11.64,33.4 11.27,33.02 10,33.02 9.05,33.97 v6.5,33.97 | v4.92,51.44 R131.1
  Bottom 0.305: v6.5,33.97 6.19,34.29 6.19,38.1 5.87,38.42 5.87,41.91 5.24,42.55 5.24,51.12 v4.92,51.44
TRG4  (via drill 0.5)
  Top 0.305: IC1.2 12.44,34.83 v12.54,34.92 | v12.22,59.37 v4.92,59.37 | v4.28,64.14 R141.1
  Bottom 0.305: v12.54,34.92 12.54,36.51 13.49,37.47 13.49,41.59 12.54,42.55 12.54,44.77 11.9,45.4 11.9,59.05 v12.22,59.37 | v4.92,59.37 4.28,60.01 v4.28,64.14
TRG5  (via drill 0.5)
  Top 0.305: R151.1 v4.6,76.83 | v5.55,60.64 v17.94,60.64 | IC1.9 19.9,35.3 v20.48,35.88
  Bottom 0.305: v4.6,76.83 5.24,76.2 5.24,60.96 v5.55,60.64 | v17.94,60.64 17.62,60.33 17.62,50.16 17.94,49.85 17.94,42.86 20.16,40.64 20.16,36.2 v20.48,35.88

### Text on the board
tPlace: Triggy Rev01 | Rebel Technology | -12
bPlace: Rebel Technology | -12